# EAGLE design Puzzle Switch v1.0 (EAGLE 6.6.0)
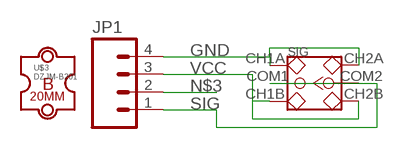
[diagram p0: schematic, sheet 1]

## Parts
JP1  M04POLAR  [JMZY-1X4]
SIG  SWITCH-2CH-6P  [6P-2CH-2.54-7.6X3.0]
U$3  DZJM-B201  [DZJM-B20-1P]

## Nets
GND: JP1.4 SIG.CH1A SIG.CH2A
N$3: JP1.2
SIG: JP1.1 SIG.COM1 SIG.COM2
VCC: JP1.3 SIG.CH1B SIG.CH2B

## Library data of the parts
JP1 = 元器库-连接件:M04: Header 4 Standard 4-pin 0.1" header. Use with straight break away headers (SKU : PRT-00116), right angle break away headers (PRT-00553), swiss pins (PRT-00743), machine pins (PRT-00117), and female headers (PRT-00115). Molex polarized connector foot print use with SKU : PRT-08231 with associated crimp pins and housings. 1MM SMD Version SKU: PRT-10208
SIG = Discrete:SWITCH-2CH-6P
U$3 = 元件库-模块板:DZJM-B20

## Board
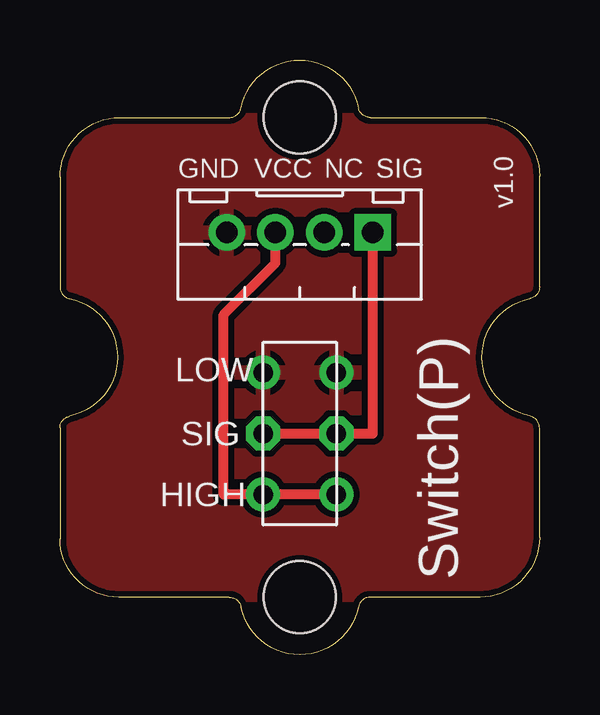
[diagram p1: board, top side]
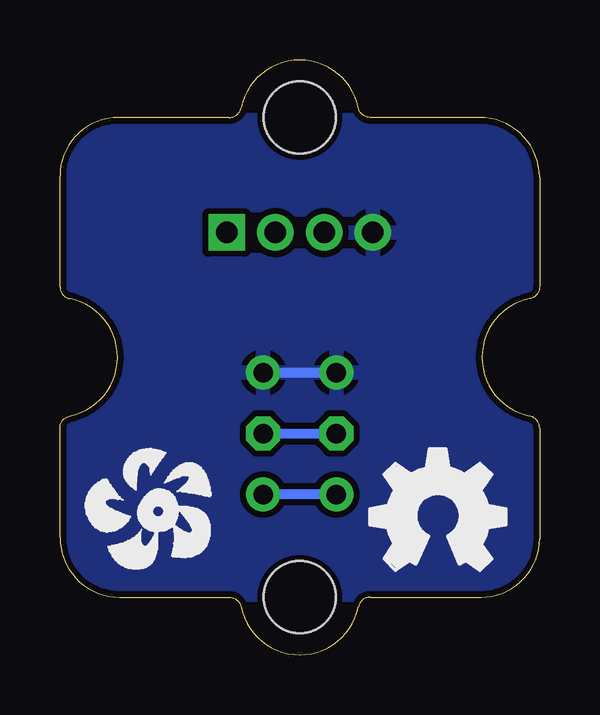
[diagram p2: board, bottom side, seen from below]

Size 20 x 24.8 mm. Coordinates in mm from the lower left corner, seen from the top.
Copper layers (1*16): Top 0.035mm / dielectric 1.5mm / Bottom 0.035mm
Design rules "Sparkfun *": minimum track width 16mil, minimum drill 12mil, track to track 8mil, track to pad 8mil, pad to pad 8mil, via to via 8mil, smd to smd 8mil, copper to edge 10mil, drill to drill 8mil, minimum pad ring 12mil, minimum via ring 10mil, stop-mask expansion 4mil, vias tented up to drill 25mil, thermal gap 10mil

### Footprints (pad centres in the part's own frame; a part is rotated, then mirrored left to right if it is on the bottom)
JMZY-1X4 = drill 0.889 pad 1.524 square: 1 2.032,1.778 | drill 0.889 pad 1.524: 2 4.064,1.778; 3 6.096,1.778; 4 8.128,1.778
6P-2CH-2.54-7.6X3.0 = drill 0.813 pad 1.27: CH1A -1.524,2.54; CH1B -1.524,-2.54; CH2A 1.524,2.54; CH2B 1.524,-2.54 | drill 0.813 pad 1.27 octagon: COM1 -1.524,0; COM2 1.524,0
DZJM-B20-1P = hole 3: 0,10; 0,-10

### Placement (x,y rotation side)
JP1  15.08,19.39 180 top
SIG  10,9.23 0 top
U$2  [OSHW_FILLX200_NOTEXT]  7.08,3.51 0 bottom
U$3  10,12.4 0 top
U$4  [DUINOFUN-LOGO-PCB-0.7]  19.02,3.51 0 bottom

### Tracks (layer width: path | path; a pad name or v marks a point on that pad's centre or on a via)
GND
  Bottom 0.406: SIG.CH2A SIG.CH1A
  pour Bottom (isolate 0.254): -0.03,25.1 20.29,25.1 20.29,-0.3 -0.03,-0.3
  pour Top (isolate 0.254): -0.03,25.1 20.29,25.1 20.29,-0.3 -0.03,-0.3
SIG
  Top 0.406: SIG.COM1 13.05,9.23 JP1.1
  Bottom 0.406: SIG.COM2 SIG.COM1
VCC
  Top 0.406: SIG.CH2B 6.83,6.69 6.83,14.18 8.98,16.34 JP1.3
  Bottom 0.406: SIG.CH1B SIG.CH2B

### Text on the board
tPlace: GND | VCC | NC | SIG | v1.0 | LOW | SIG | HIGH | Switch(P)